# EAGLE design LZ4 (EAGLE 6.1)
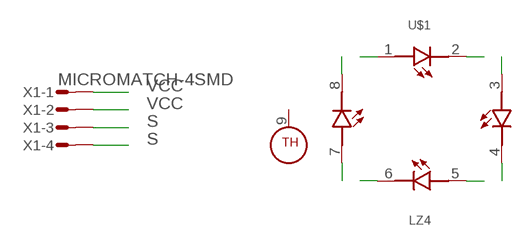
[diagram p0: schematic, sheet 1]

## Parts
U$1  LZ4  [LZ4]
X1  MICROMATCH-4SMD  [MICROMATCH-4SMD]

## Nets
2: U$1.2 U$1.3
3: U$1.4 U$1.5
4: U$1.6 U$1.7
S: U$1.8 X1.3 X1.4
VCC: U$1.1 X1.1 X1.2
Unconnected: U$1.9

## Library data of the parts
U$1 = Power_Led:LZ4
X1 = Con-amp-micromatch (2):MICROMATCH-4: MicroMaTch 4 7-215464-4 / 0-215464-4 Drawing Number C-215464 DDEController.pdf

## Board
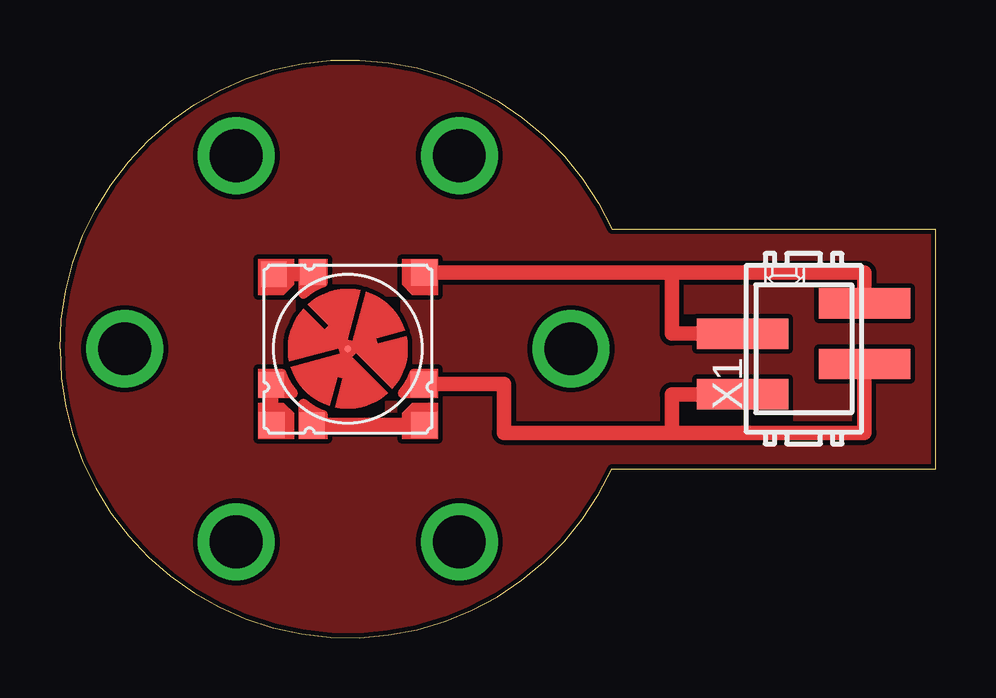
[diagram p1: board, top side]

Size 36.5 x 24.08 mm. Coordinates in mm from the lower left corner, seen from the top.
Outline: 23,17.04 36.5,17.04 36.5,7.04 23,7.04 arc-156 0,12.04 arc-156 23,17.04
Copper layers (1*16): Top 0.035mm / dielectric 1.5mm / Bottom 0.035mm
Design rules: minimum track width 10mil, minimum drill 24mil, track to track 0.15mm, track to pad 8mil, pad to pad 8mil, via to via 8mil, smd to smd 8mil, copper to edge 0.2mm, drill to drill 8mil, minimum pad ring 10mil, minimum via ring 8mil, stop-mask expansion 4mil, vias tented up to drill 0mil, thermal gap 10mil

### Footprints (pad centres in the part's own frame; a part is rotated, then mirrored left to right if it is on the bottom)
LZ4 = smd 1.07 x 1.07: 1 3.175,3.175; 2 -1.465,3.195; 3 -3.085,3.105; 4 -3.195,-1.495; 5 -3.175,-3.175; 6 -1.495,-3.195; 7 3.175,-3.175; 8 3.155,-1.475 | smd 0.3 x 0.3: 9 0,0
MICROMATCH-4SMD = smd 1.27 x 3.81: 1 1.905,-2.54; 2 0.635,2.54; 3 -0.635,-2.54; 4 -1.905,2.54

### Placement (x,y rotation side)
U$1  12,12.04 0 top
X1  31,12.04 90 top

### Tracks (layer width: path | path; a pad name or v marks a point on that pad's centre or on a via)
2
  Top 0.61: U$1.3 10.54,15.15 U$1.2
3
  Top 0.61: U$1.5 8.8,8.87 U$1.4
4
  Top 0.61: U$1.7 10.5,8.87 U$1.6
N$1  (via drill 2.2)
  other vias: 2.7,12.04
N$2  (via drill 2.2)
  other vias: 16.65,20.1
N$3  (via drill 2.2)
  other vias: 7.35,20.1
N$4
  pour Top (isolate 0.2): 0,12.04 arc-90 12,24.04 arc-65 23,17.04 36.5,17.04 36.5,7.04 23,7.04 arc-65 12,0.04 arc-90
N$6  (via drill 2.2)
  other vias: 21.3,12.04
N$7  (via drill 2.2)
  other vias: 7.35,3.99
N$8  (via drill 2.2)
  other vias: 16.65,3.99
S
  Top 0.61: U$1.8 18.5,10.57 18.5,8.54 25.5,8.54 | 25.5,8.54 33.54,8.54 X1.3 | X1.4 25.5,10.14 25.5,8.54
VCC
  Top 0.61: U$1.1 25.5,15.22 | 25.5,15.22 33.54,15.22 X1.1 | X1.2 25.5,12.68 25.5,15.22